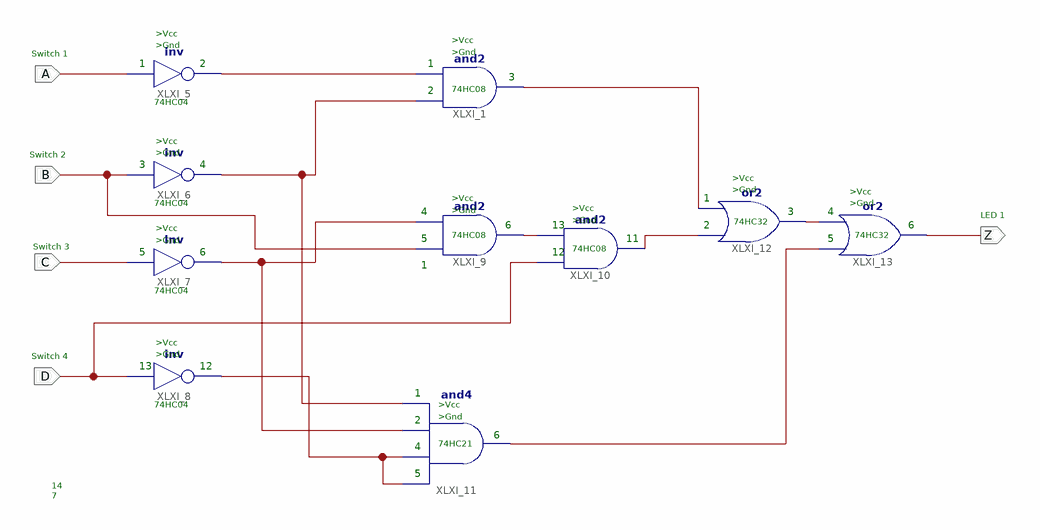
[diagram p0: schematic sheet 1]
// Xilinx ISE schematic p1ej2aor.sch (spartan3) as structural Verilog: 10 symbols, 5 ports
module p1ej2aor (
  input  A,
  input  B,
  input  C,
  input  D,
  output Z
);

  wire XLXN_1, XLXN_2, XLXN_3, XLXN_10, XLXN_12, XLXN_14, XLXN_16, XLXN_18, XLXN_19;

  and XLXI_1 (XLXN_1, XLXN_12, XLXN_10);
  not XLXI_5 (XLXN_10, A);
  not XLXI_6 (XLXN_12, B);
  not XLXI_7 (XLXN_14, C);
  not XLXI_8 (XLXN_18, D);
  and XLXI_9 (XLXN_16, B, XLXN_14);
  and XLXI_10 (XLXN_2, D, XLXN_16);
  and XLXI_11 (XLXN_3, XLXN_18, XLXN_18, XLXN_14, XLXN_12);
  or XLXI_12 (XLXN_19, XLXN_2, XLXN_1);
  or XLXI_13 (Z, XLXN_3, XLXN_19);

  // Notes on the sheet:
  //   >Vcc
  //   >Vcc
  //   >Gnd
  //   >Gnd
  //   Switch 1
  //   1
  //   2
  //   1
  //   3
  //   74HC08
  //   2
  //   74HC04
  //   >Vcc
  //   >Gnd
  //   Switch 2
  //   3
  //   4
  //   >Vcc
  //   >Gnd
  //   >Vcc
  //   >Vcc
  //   1
  //   74HC04
  //   >Gnd
  //   >Vcc
  //   >Gnd
  //   4
  //   3
  //   4
  //   LED 1
  //   >Gnd
  //   74HC32
  //   6
  //   13
  //   2
  //   6
  //   >Vcc
  //   74HC08
  //   74HC32
  //   5
  //   11
  //   5
  //   >Gnd
  //   Switch 3
  //   74HC08
  //   5
  //   6
  //   12
  //   1
  //   74HC04
  //   >Vcc
  //   >Gnd
  //   Switch 4
  //   13
  //   12
  //   1
  //   74HC04
  //   >Vcc
  //   >Gnd
  //   2
  //   6
  //   74HC21
  //   4
  //   5
  //   14
  //   7
endmodule
